# Altium schematic sheet GR740.SchDoc
size A4
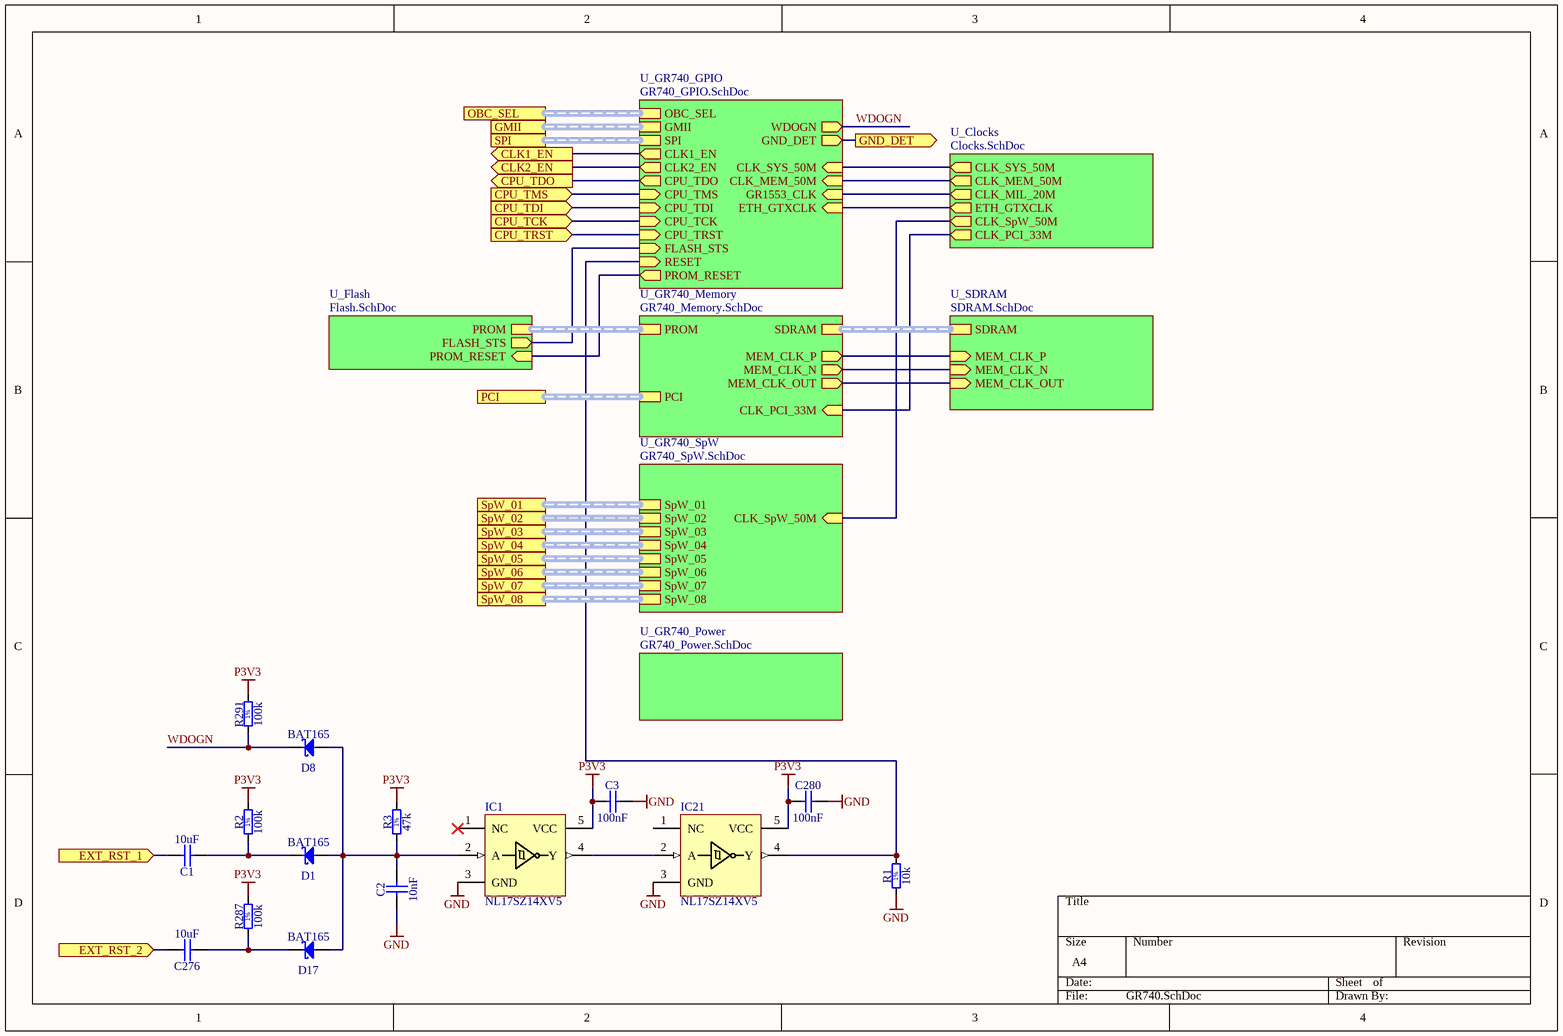
[diagram p0: GR740.SchDoc]

## Parts
C1  10uF  [CAPC1608X80N]
C2  10nF  [CAPC1005X55N]
C3  100nF  [CAPC1005X55N]
C276  10uF  [CAPC1608X80N]
C280  100nF  [CAPC1005X55N]
D1  BAT165  [SOD2512X110N]
D8  BAT165  [SOD2512X110N]
D17  BAT165  [SOD2512X110N]
IC1  NL17SZ14XV5  [SOT50P160X60-5N]
IC21  NL17SZ14XV5  [SOT50P160X60-5N]
R1  10k  [RESC1005X40N]
R2  100k  [RESC1005X40N]
R3  47k  [RESC1005X40N]
R287  100k  [RESC1005X40N]
R291  100k  [RESC1005X40N]

## Sub-sheets
U_Clocks = Clocks.SchDoc: CLK_SpW_50M (out), CLK_SYS_50M (out), CLK_MEM_50M (out), CLK_MIL_20M (out), CLK_PCI_33M (out), ETH_GTXCLK (out)
U_Flash = Flash.SchDoc: PROM (harness PROM), FLASH_STS (out), PROM_RESET (in)
U_GR740_GPIO = GR740_GPIO.SchDoc: CLK_SYS_50M (in), CLK_MEM_50M (in), RESET (in), GR1553_CLK (in), ETH_GTXCLK (in), SPI (harness SPI), GMII (harness GMII), CPU_TDO (out), CPU_TMS (in), CPU_TDI (in), CPU_TCK (in), CPU_TRST (in), OBC_SEL (harness OBC_SEL), CLK2_EN (out), CLK1_EN (out), WDOGN (out), FLASH_STS (in), PROM_RESET (out), GND_DET (out)
U_GR740_Memory = GR740_Memory.SchDoc: SDRAM (harness SDRAM), PCI (harness PCI), MEM_CLK_P (out), MEM_CLK_N (out), MEM_CLK_OUT (out), PROM (harness PROM), CLK_PCI_33M (in)
U_GR740_Power = GR740_Power.SchDoc: no entries
U_GR740_SpW = GR740_SpW.SchDoc: CLK_SpW_50M (in), SpW_03 (harness SpW), SpW_04 (harness SpW), SpW_01 (harness SpW), SpW_02 (harness SpW), SpW_07 (harness SpW), SpW_08 (harness SpW), SpW_05 (harness SpW), SpW_06 (harness SpW)
U_SDRAM = SDRAM.SchDoc: SDRAM (harness SDRAM), MEM_CLK_P (in), MEM_CLK_N (in), MEM_CLK_OUT (in)

## Ports
CLK1_EN (out), CLK2_EN (out), CPU_TCK (in), CPU_TDI (in), CPU_TDO (out), CPU_TMS (in), CPU_TRST (in), EXT_RST_1 (in), EXT_RST_2 (in), GMII (harness GMII), GND_DET (out), OBC_SEL (harness OBC_SEL), PCI (harness PCI), SPI (harness SPI), SpW_01 (harness SpW), SpW_02 (harness SpW), SpW_03 (harness SpW), SpW_04 (harness SpW), SpW_05 (harness SpW), SpW_06 (harness SpW), SpW_07 (harness SpW), SpW_08 (harness SpW)

## Nets
GND: C2.1 C3.2 C280.2 IC1.3(GND) IC21.3(GND) R1.1
P3V3: C3.1 C280.1 IC1.5(VCC) IC21.5(VCC) R2.2 R3.2 R287.2 R291.2
CLK1_EN: port CLK1_EN, sheet U_GR740_GPIO/CLK1_EN
CLK2_EN: port CLK2_EN, sheet U_GR740_GPIO/CLK2_EN
CPU_TCK: port CPU_TCK, sheet U_GR740_GPIO/CPU_TCK
CPU_TDI: port CPU_TDI, sheet U_GR740_GPIO/CPU_TDI
CPU_TDO: port CPU_TDO, sheet U_GR740_GPIO/CPU_TDO
CPU_TMS: port CPU_TMS, sheet U_GR740_GPIO/CPU_TMS
CPU_TRST: port CPU_TRST, sheet U_GR740_GPIO/CPU_TRST
EXT_RST_1: C1.2 ; port EXT_RST_1
EXT_RST_2: C276.2 ; port EXT_RST_2
GND_DET: port GND_DET, sheet U_GR740_GPIO/GND_DET
WDOGN: D8.1(C) R291.1 ; sheet U_GR740_GPIO/WDOGN
NetC1_1: C1.1 D1.1(C) R2.1
NetC2_2: C2.2 D1.2(A) D8.2(A) D17.2(A) IC1.2(A) R3.1
NetC276_1: C276.1 D17.1(C) R287.1
NetIC1_4: IC1.4(Y) IC21.2(A)
NetIC21_4: IC21.4(Y) R1.2 ; sheet U_GR740_GPIO/RESET
(unnamed): sheet U_GR740_GPIO/CLK_SYS_50M, sheet U_Clocks/CLK_SYS_50M
(unnamed): sheet U_GR740_GPIO/CLK_MEM_50M, sheet U_Clocks/CLK_MEM_50M
(unnamed): sheet U_GR740_GPIO/GR1553_CLK, sheet U_Clocks/CLK_MIL_20M
(unnamed): sheet U_GR740_GPIO/ETH_GTXCLK, sheet U_Clocks/ETH_GTXCLK
(unnamed): sheet U_GR740_GPIO/FLASH_STS, sheet U_Flash/FLASH_STS
(unnamed): sheet U_GR740_GPIO/PROM_RESET, sheet U_Flash/PROM_RESET
(unnamed): sheet U_GR740_Memory/MEM_CLK_P, sheet U_SDRAM/MEM_CLK_P
(unnamed): sheet U_GR740_Memory/MEM_CLK_N, sheet U_SDRAM/MEM_CLK_N
(unnamed): sheet U_GR740_Memory/MEM_CLK_OUT, sheet U_SDRAM/MEM_CLK_OUT
(unnamed): sheet U_GR740_Memory/CLK_PCI_33M, sheet U_Clocks/CLK_PCI_33M
(unnamed): sheet U_GR740_SpW/CLK_SpW_50M, sheet U_Clocks/CLK_SpW_50M

Not connected (* = marked no-connect by the designer): IC1 1(NC)*; IC21 1(NC)

## Buses and harness runs
harness port GMII = sheet U_GR740_GPIO/GMII
harness port OBC_SEL = sheet U_GR740_GPIO/OBC_SEL
harness port PCI = sheet U_GR740_Memory/PCI
harness port SPI = sheet U_GR740_GPIO/SPI
harness port SpW_01 = sheet U_GR740_SpW/SpW_01
harness port SpW_02 = sheet U_GR740_SpW/SpW_02
harness port SpW_03 = sheet U_GR740_SpW/SpW_03
harness port SpW_04 = sheet U_GR740_SpW/SpW_04
harness port SpW_05 = sheet U_GR740_SpW/SpW_05
harness port SpW_06 = sheet U_GR740_SpW/SpW_06
harness port SpW_07 = sheet U_GR740_SpW/SpW_07
harness port SpW_08 = sheet U_GR740_SpW/SpW_08
harness sheet U_Flash/PROM = sheet U_GR740_Memory/PROM
harness sheet U_GR740_Memory/SDRAM = sheet U_SDRAM/SDRAM

## Notes on the sheet
- (in symbol R0402_10K_1%_0.0625W_100PPM) 1%
- (in symbol R0402_47K_1%_0.0625W_100PPM) 1%
- (in symbol R0402_100K_1%_0.0625W_100PPM) 1%

## Library data of the parts
C1 C276 = CC0603_10UF_16V_20%_X5R: Non-polarised capacitor; Part Description: SMD Multilayer Chip Ceramic Capacitor; Manufacturer: GENERIC; Manufacturer1 Part Number: GRM188R61C106MA73D; Voltage: 16V; TC: X5R; Tolerance: ±20%; Part Number: CC0603_10UF_16V_20%_X5R; Component Kind: Standard; Component Type: Standard; Pin Count: 2; Value: 10uF; Status: None; Manufacturer Part Number: CC0603_10UF_16V_20%_X5R; Case: 0603; Mounted: Yes; Socket: No; SMD: Yes; Sense: No; Manufacturer1 Example: MURATA; Manufacturer1 ComponentHeight: 0.8mm; HelpURL: \\cern.ch\dfs\Applications\Altium\Datasheets\CC0603_X5R_MURATA_GRM.pdf; Author: CERN DEM MR; CreateDate: 2016-03-02; LatestRevisionDate: 2016-03-02
C2 = CC0402_10NF_50V_10%_X7R: Non-polarised capacitor; Part Description: SMD Multilayer Chip Ceramic Capacitor; Manufacturer: GENERIC; Manufacturer1 Part Number: GRM155R71H103KA88D; Voltage: 50V; TC: X7R; Tolerance: ±10%; Part Number: CC0402_10NF_50V_10%_X7R; Component Kind: Standard; Component Type: Standard; Pin Count: 2; Value: 10nF; Status: None; Manufacturer Part Number: CC0402_10NF_50V_10%_X7R; Case: 0402; Mounted: Yes; Socket: No; SMD: Yes; Sense: No; Manufacturer1 Example: MURATA; Manufacturer1 ComponentHeight: 0.55mm; HelpURL: \\cern.ch\dfs\Applications\Altium\Datasheets\CC0402_X7R_MURATA_GRM.pdf; Author: CERN DEM MR; CreateDate: 08.01.2016; LatestRevisionDate: 08.01.2016
C3 C280 = CC0402_100NF_25V_10%_X7R_YUDEN_TMK105B7104KVHF: Non-polarised capacitor; Part Description: SMD Multilayer Chip Ceramic Capacitor (High Dielectric Type) for Automotive / Industrial Applications; Manufacturer: TAIYO YUDEN; Voltage: 25V; TC: X7R; Tolerance: ±10%; Part Number: CC0402_100NF_25V_10%_X7R_YUDEN_TMK105B7104KVHF; Component Kind: Standard; Component Type: Standard; Pin Count: 2; Value: 100nF; Status: Not Recommended; Manufacturer Part Number: TMK105B7104KVHF; Case: 0402; Mounted: Yes; Socket: No; SMD: Yes; Sense: No; HelpURL: \\cern.ch\dfs\Applications\Altium\Datasheets\CC0402_TAIYO-YUDEN_TMK105B7104KVHF.pdf; Author: CERN DEM JLC; CreateDate: 10.05.2017; LatestRevisionDate: 10.05.2017; ComponentHeight: 0.55mm
D1 D8 D17 = BAT165: Schottky Diode; Part Description: Medium Power AF Schottky Diode; Manufacturer: INFINEON; Voltage: 40V; Power: 750mA; PressFit: No; Bonding: No; Part Number: BAT165; Component Kind: Standard; Component Type: Standard; Device: BAT165; PackageDescription: Small Outline Diode (SOD-323), 1.70mm W X 1.25mm L X 1.10mm H body,  IPC Medium Density; Manufacturer Part Number: BAT165; Pin Count: 2; Case: SOD323; Mounted: Yes; Socket: No; SMD: Yes; Sense: No; ComponentHeight: 1.1mm; HelpURL: \\cern.ch\dfs\Applications\Altium\Datasheets\BAT165.pdf; Author: CERN DEM JLC; CreateDate: 12.11.2014; LatestRevisionDate: 12.11.2014
IC1 IC21 = NL17SZ14XV5: Single inverter with schmitt trigger; Manufacturer: On Semiconductor; Bonding: No; ComponentHeigth: 0.55mm; PressFit: No; Case: SOT-553; Component Kind: Standard; Component Type: Standard; CreateDate: 2019-05-06; Device: NL17SZ14XV5; Footprint: SOT23-5; HelpURL: https://www.onsemi.com/pub/Collateral/NL17SZ14-D.PDF; LatestRevisionDate: 2018-01-01; Manufacturer Part Number: NL17SZ14XV5; Mounted: Yes; PackageDescription: Body 1.6x1.2mm, Pitch 0.5mm; Part Description: Single inverter with schmitt trigger; Part Number: NL17SZ14XV5; Pin Count: 5; Sense: No; SMD: Yes; Socket: No; Value: *
R1 = R0402_10K_1%_0.0625W_100PPM: Resistor - 1%; Part Description: General Purpose Thick Film Chip Resistor; Manufacturer: GENERIC; Manufacturer1 Part Number: 232270671003L; TC: ±100ppm/°C; PressFit: No; Part Number: R0402_10K_1%_0.0625W_100PPM; Component Kind: Standard; Component Type: Standard; Pin Count: 2; Value: 10k; Status: Not Recommended; Power: 0.0625W; Tolerance: ±1%; Manufacturer Part Number: R0402_10K_1%_0.0625W_100PPM; Case: 0402; Mounted: Yes; Sense: No; Socket: No; SMD: Yes; Manufacturer1 Example: YAGEO PHYCOMP; Manufacturer1 ComponentHeight: 0.4mm; HelpURL: \\cern.ch\dfs\Applications\Altium\Datasheets\R0402_Phycomp_RC0402.pdf; Author: CERN DEM JLC; CreateDate: 03.12.2007; LatestRevisionDate: 17.10.2012
R2 R287 R291 = R0402_100K_1%_0.0625W_100PPM: Resistor - 1%; Part Description: General Purpose Thick Film Chip Resistor; Manufacturer: GENERIC; Manufacturer1 Part Number: 232270671004L; TC: ±100ppm/°C; PressFit: No; Part Number: R0402_100K_1%_0.0625W_100PPM; Component Kind: Standard; Component Type: Standard; Pin Count: 2; Value: 100k; Status: Not Recommended; Power: 0.0625W; Tolerance: ±1%; Manufacturer Part Number: R0402_100K_1%_0.0625W_100PPM; Case: 0402; Mounted: Yes; Sense: No; Socket: No; SMD: Yes; Manufacturer1 Example: YAGEO PHYCOMP; Manufacturer1 ComponentHeight: 0.4mm; HelpURL: \\cern.ch\dfs\Applications\Altium\Datasheets\R0402_Phycomp_RC0402.pdf; Author: CERN DEM JLC; CreateDate: 03.12.2007; LatestRevisionDate: 17.10.2012
R3 = R0402_47K_1%_0.0625W_100PPM: Resistor - 1%; Part Description: General Purpose Thick Film Chip Resistor; Manufacturer: GENERIC; Manufacturer1 Part Number: 232270675103L; TC: ±100ppm/°C; PressFit: No; Part Number: R0402_47K_1%_0.0625W_100PPM; Component Kind: Standard; Component Type: Standard; Pin Count: 2; Value: 47k; Status: Not Recommended; Power: 0.0625W; Tolerance: ±1%; Manufacturer Part Number: R0402_47K_1%_0.0625W_100PPM; Case: 0402; Mounted: Yes; Sense: No; Socket: No; SMD: Yes; Manufacturer1 Example: YAGEO PHYCOMP; Manufacturer1 ComponentHeight: 0.4mm; HelpURL: \\cern.ch\dfs\Applications\Altium\Datasheets\R0402_Phycomp_RC0402.pdf; Author: CERN DEM JLC; CreateDate: 03.12.2007; LatestRevisionDate: 17.10.2012